# Altium schematic sheet mcu.SchDoc
size A4
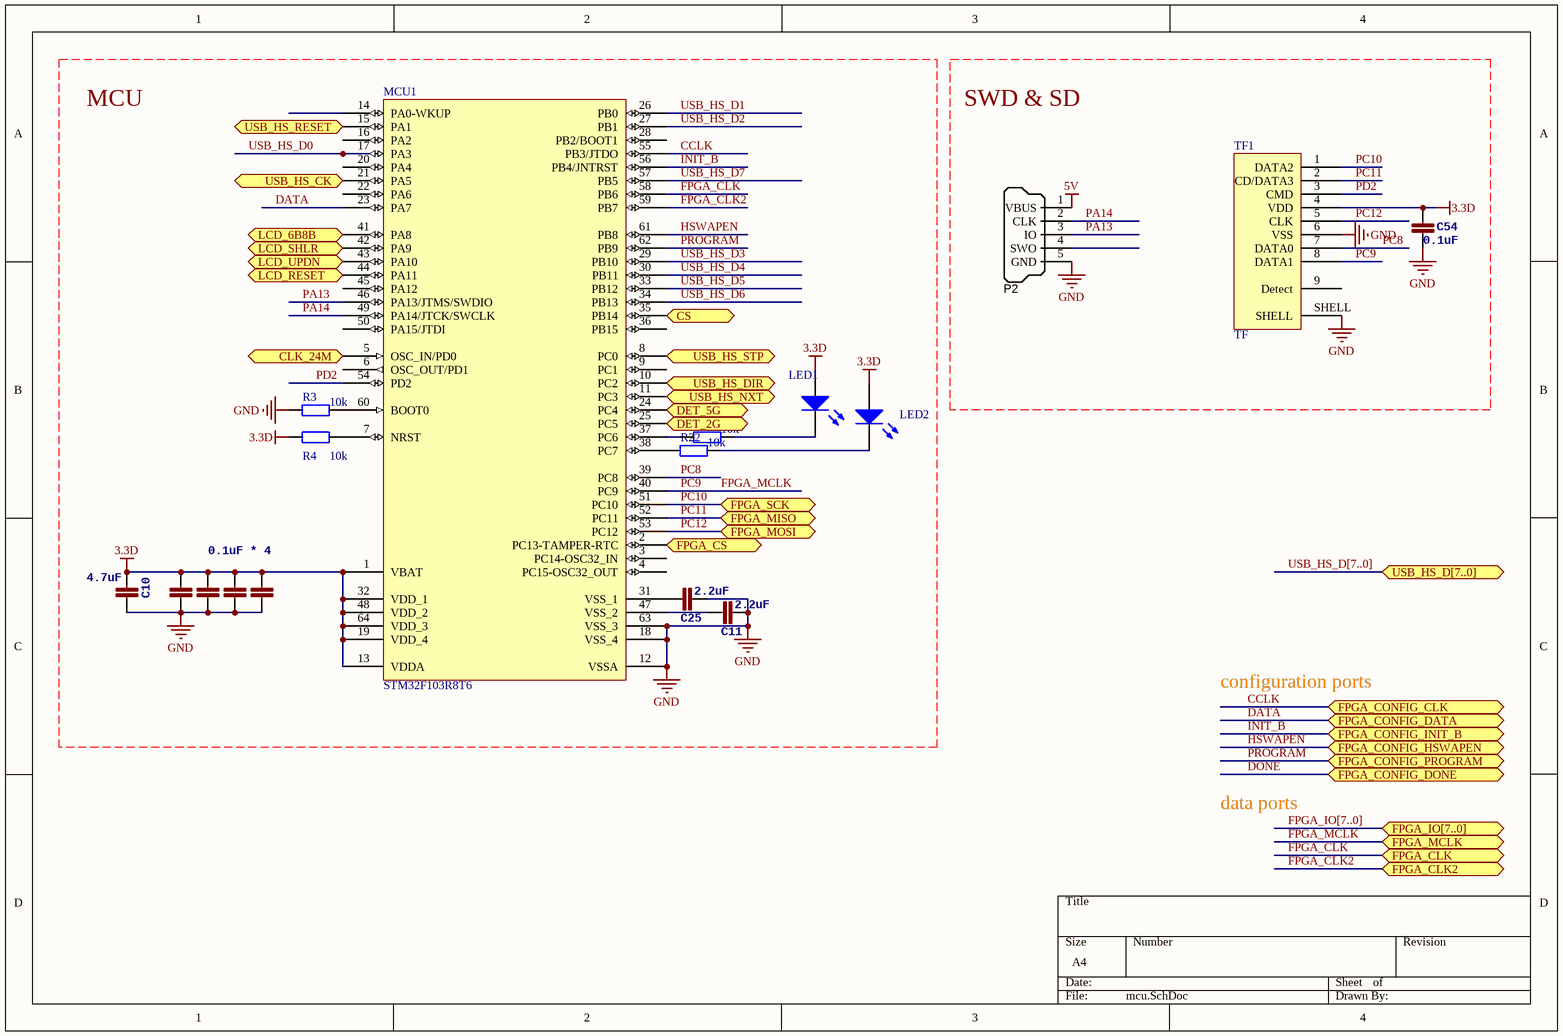
[diagram p0: mcu.SchDoc]

## Parts
C4  0.1uF * 4  [0402]
C5  1n  [0402]  (value not drawn)
C6  1n  [0402]  (value not drawn)
C7  1n  [0402]  (value not drawn)
C10  4.7uF  [0603]
C11  2.2uF  [0603]
C25  2.2uF  [0603]
C54  0.1uF  [0402]
LED1  LED0  [0603]  (value not drawn)
LED2  LED0  [0603]  (value not drawn)
MCU1  STM32F103R8T6  [LQFP64_N]
P2  SWD_MicroUSB  [MICRO-YZX]  (value not drawn)
R3  10k  [0402]
R4  10k  [0402]
R21  10k  [0402]
R22  10k  [0402]
TF1  TF  [TF]

## Ports
CLK_24M, CS, DET_2G, DET_5G, FPGA_CLK, FPGA_CLK2, FPGA_CONFIG_CLK, FPGA_CONFIG_DATA, FPGA_CONFIG_DONE, FPGA_CONFIG_HSWAPEN, FPGA_CONFIG_INIT_B, FPGA_CONFIG_PROGRAM, FPGA_CS, FPGA_IO[7..0], FPGA_MCLK, FPGA_MISO, FPGA_MOSI, FPGA_SCK, LCD_6B8B, LCD_RESET, LCD_SHLR, LCD_UPDN, USB_HS_CK, USB_HS_D[7..0], USB_HS_DIR, USB_HS_NXT, USB_HS_RESET, USB_HS_STP

## Nets
3.3D: C4.2 C5.2 C6.2 C7.2 C10.2 C54.2 LED1.1(A) LED2.1(A) MCU1.1(VBAT) MCU1.13(VDDA) MCU1.19(VDD_4) MCU1.32(VDD_1) MCU1.48(VDD_2) MCU1.64(VDD_3) R4.2 TF1.4(VDD)
5V: P2.1(VBUS)
GND: C4.1 C5.1 C6.1 C7.1 C10.1 C11.2 C25.2 C54.1 MCU1.12(VSSA) MCU1.18(VSS_4) MCU1.63(VSS_3) P2.5(GND) R3.1 TF1.6(VSS) TF1.SHELL
CCLK: MCU1.55(PB3/JTDO) ; port FPGA_CONFIG_CLK
CLK_24M: MCU1.5(OSC_IN/PD0) ; port CLK_24M
CS: MCU1.35(PB14) ; port CS
DATA: MCU1.23(PA7) ; port FPGA_CONFIG_DATA
DET_2G: MCU1.25(PC5) ; port DET_2G
DET_5G: MCU1.24(PC4) ; port DET_5G
DONE: port FPGA_CONFIG_DONE
FPGA_CLK: MCU1.58(PB6) ; port FPGA_CLK
FPGA_CLK2: MCU1.59(PB7) ; port FPGA_CLK2
FPGA_CS: MCU1.2(PC13-TAMPER-RTC) ; port FPGA_CS
FPGA_MCLK: MCU1.40(PC9) TF1.8(DATA1) ; port FPGA_MCLK  [also labelled PC9]
HSWAPEN: MCU1.61(PB8) ; port FPGA_CONFIG_HSWAPEN
INIT_B: MCU1.56(PB4/JNTRST) ; port FPGA_CONFIG_INIT_B
LCD_6B8B: MCU1.41(PA8) ; port LCD_6B8B
LCD_RESET: MCU1.44(PA11) ; port LCD_RESET
LCD_SHLR: MCU1.42(PA9) ; port LCD_SHLR
LCD_UPDN: MCU1.43(PA10) ; port LCD_UPDN
PA13: MCU1.46(PA13/JTMS/SWDIO) P2.3(IO)
PA14: MCU1.49(PA14/JTCK/SWCLK) P2.2(CLK)
PC8: MCU1.39(PC8) TF1.7(DATA0)
PC10: MCU1.51(PC10) TF1.1(DATA2) ; port FPGA_SCK
PC11: MCU1.52(PC11) TF1.2(CD/DATA3) ; port FPGA_MISO
PC12: MCU1.53(PC12) TF1.5(CLK) ; port FPGA_MOSI
PD2: MCU1.54(PD2) TF1.3(CMD)
PROGRAM: MCU1.62(PB9) ; port FPGA_CONFIG_PROGRAM
USB_HS_CK: MCU1.21(PA5) ; port USB_HS_CK
USB_HS_D0: MCU1.17(PA3)
USB_HS_D1: MCU1.26(PB0)
USB_HS_D2: MCU1.27(PB1)
USB_HS_D3: MCU1.29(PB10)
USB_HS_D4: MCU1.30(PB11)
USB_HS_D5: MCU1.33(PB12)
USB_HS_D6: MCU1.34(PB13)
USB_HS_D7: MCU1.57(PB5)
USB_HS_DIR: MCU1.10(PC2) ; port USB_HS_DIR
USB_HS_NXT: MCU1.11(PC3) ; port USB_HS_NXT
USB_HS_RESET: MCU1.15(PA1) ; port USB_HS_RESET
USB_HS_STP: MCU1.8(PC0) ; port USB_HS_STP
NetC11_1: C11.1 MCU1.47(VSS_2)
NetC25_1: C25.1 MCU1.31(VSS_1)
NetLED1_2: LED1.2(K) R21.2
NetLED2_2: LED2.2(K) R22.2
NetMCU1_7: MCU1.7(NRST) R4.1
NetMCU1_37: MCU1.37(PC6) R21.1
NetMCU1_38: MCU1.38(PC7) R22.1
NetMCU1_60: MCU1.60(BOOT0) R3.2

Not connected (* = marked no-connect by the designer): MCU1 3(PC14-OSC32_IN) 4(PC15-OSC32_OUT) 6(OSC_OUT/PD1) 9(PC1) 14(PA0-WKUP) 16(PA2) 20(PA4) 22(PA6) 28(PB2/BOOT1) 36(PB15) 45(PA12) 50(PA15/JTDI); P2 4(SWO); TF1 9(Detect)

## Buses and harness runs
bus FPGA_IO[7..0] = port FPGA_IO[7..0]
bus USB_HS_D[7..0] = port USB_HS_D[7..0]

## Notes on the sheet
- MCU
- SWD & SD
- configuration ports
- data ports

## Library data of the parts
C4-C7 C10 C11 C25 C54 = CAP0402-CAP: <b>Capacitor</b> / Standard 0603 ceramic capacitor, and 0.1" leaded capacitor.; PARTNO: CC0402ZRY5V7BB104
LED1 LED2 = LED0: Typical INFRARED GaAs LED; Published: 8-Jun-2000; LatestRevisionDate: 08-Jul-2005; LatestRevisionNote: Mech Layer 1 removed.; PackageReference: LED-0; Publisher: Altium Limited; PackageDescription: LED; 2 Leads
MCU1 = STM32F103R8T6: STM32 ARM-based 32-bit MCU with 64 Kbytes Flash, 64-pin LQFP, Industrial Temperature; Published: *; DatasheetVersion: *; PackageVersion: *; PackageReference: *; Publisher: *; PackageDescription: *; ComponentLink1Description: *; ComponentLink1URL: *; ComponentLink2Description: *; ComponentLink2URL: *
P2 = SWD_MicroUSB: Connector SMD USB Micro Type B middle mount; Manufacturer 1: Molex Inc; SCDType: undef; Package / Case: SMD; Supplier 1: Digi-Key; Supplier Part Number 1: WM17142CT-ND
R3 R4 R21 R22 = Res2: Resistor; Value: 0Ohm; Published: 8-Jun-2000; LatestRevisionDate: 17-Jul-2002; LatestRevisionNote: Re-released for DXP Platform.; PackageReference: AXIAL-0.4; Publisher: Altium Limited; PackageDescription: Axial Device, Thru-Hole; 2 Leads; 0.4 in Pin Spacing